# EAGLE schematic ad5272_arduino_ethernet (EAGLE 8.1.1)
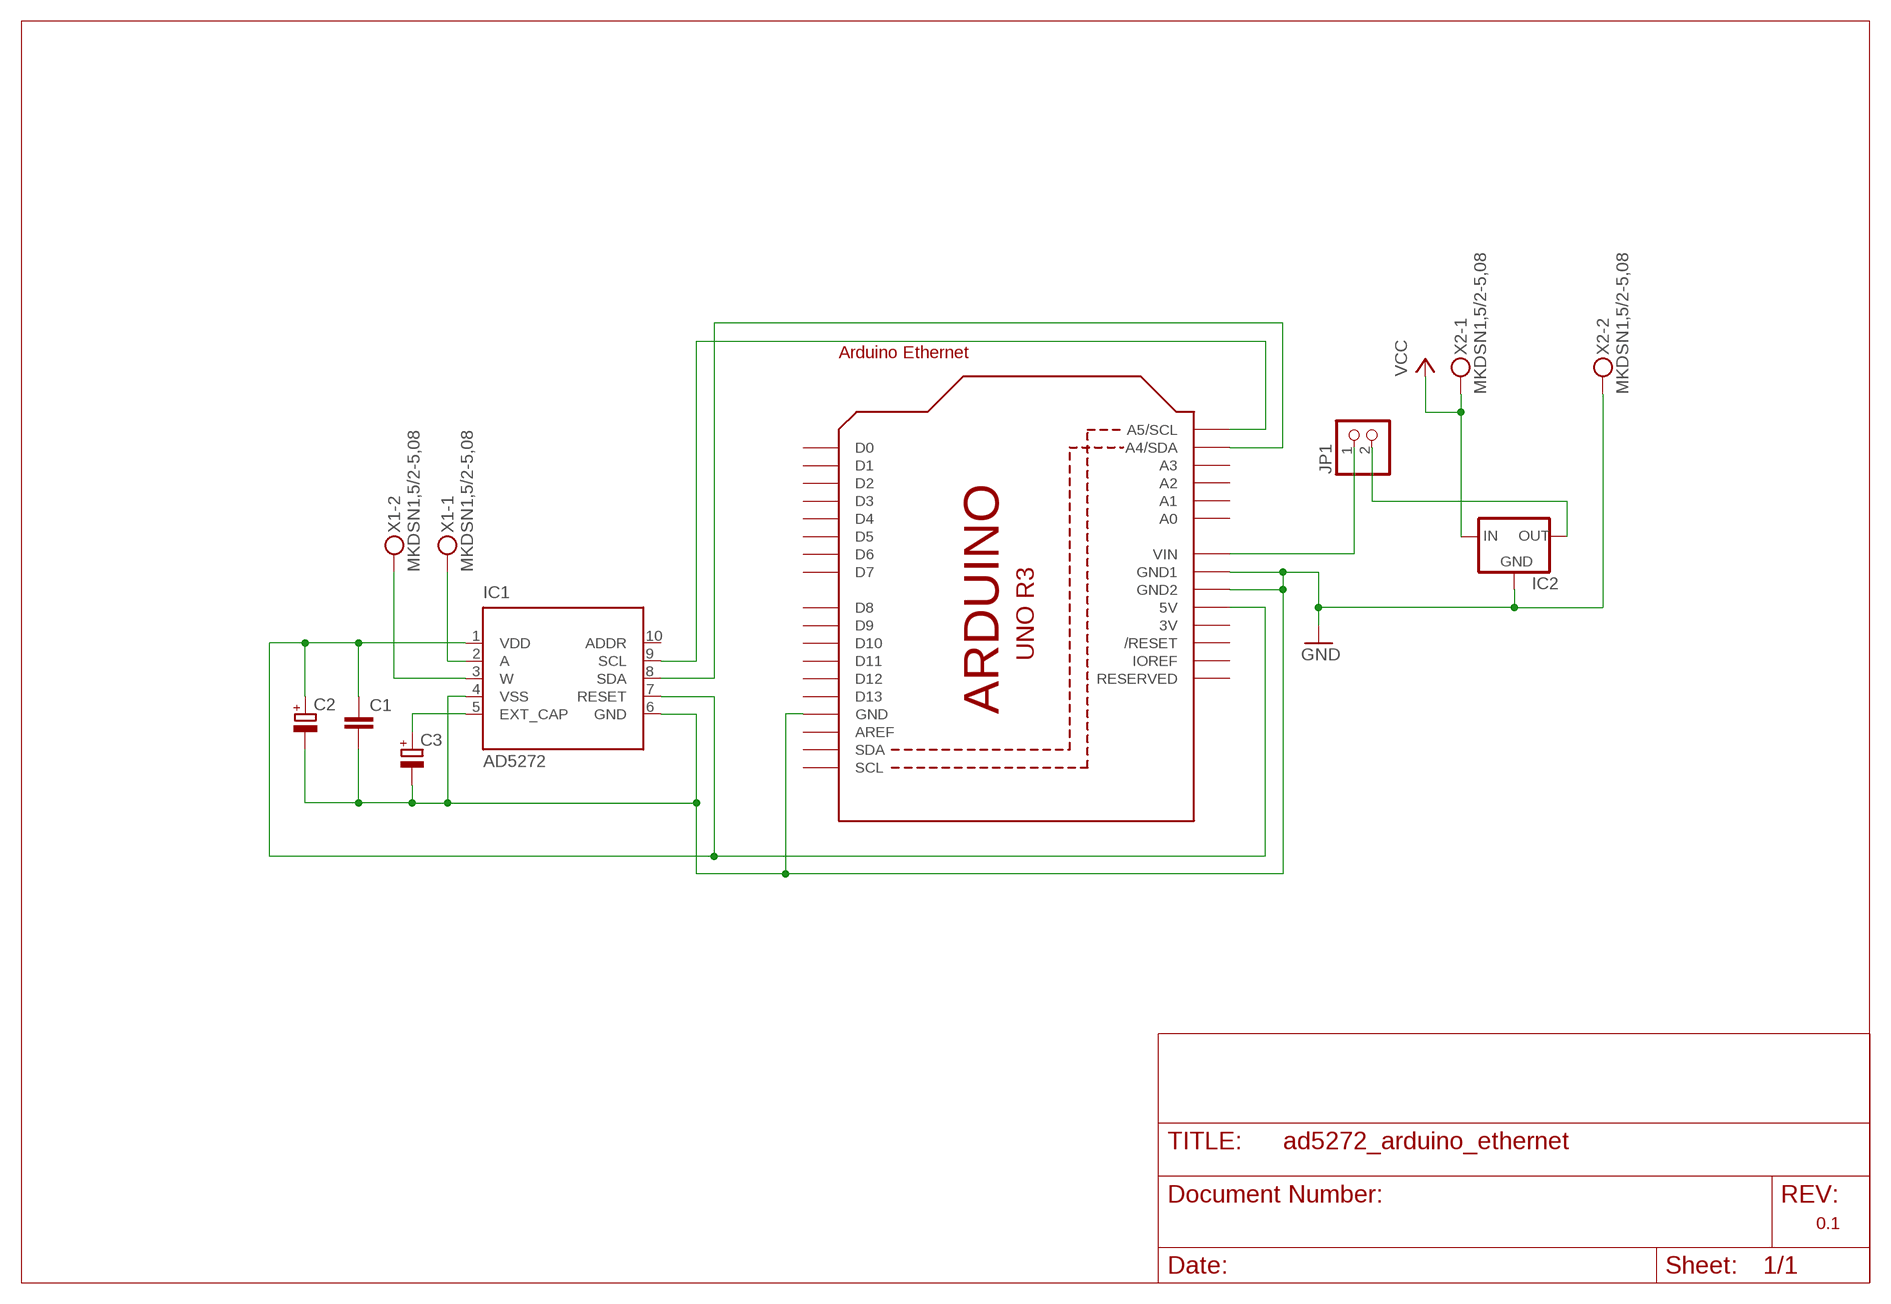
[diagram p0: schematic, sheet 1]

## Parts
C1  C-EU050-024X044  [C050-024X044]
C2  CPOL-EUE2.5-7  [E2,5-7]
C3  CPOL-EUE2.5-7  [E2,5-7]
IC1  AD5272  [MSOP10]
IC2  78XXL  [78XXL]
JP1  PINHD-1X2  [1X02]
U1  ARDUINOR3-DIMENSION  [ARDUINOR3]
X1  MKDSN1,5/2-5,08  [MKDSN1,5/2-5,08]
X2  MKDSN1,5/2-5,08  [MKDSN1,5/2-5,08]

## Nets
GND: C1.2 C2.- C3.- IC1.4(VSS) IC1.6(GND) IC2.GND U1.GND U1.GND1 U1.GND2 X2.2
N$1: IC1.9(SCL) U1.A5(A5/SCL)
N$2: IC1.8(SDA) U1.A4(A4/SDA)
N$3: IC2.OUT JP1.2
N$4: C3.+ IC1.5(EXT_CAP)
N$5: C1.1 C2.+ IC1.1(VDD) IC1.7(RESET) U1.5V
N$6: IC1.3(W) X1.2
N$7: IC1.2(A) X1.1
N$8: JP1.1 U1.VIN
VCC: IC2.IN X2.1
Unconnected: IC1.10(ADDR) U1.A0 U1.A1 U1.A2 U1.A3 U1.AREF U1.D0 U1.D1 U1.D2 U1.D3 U1.D4 U1.D5 U1.D6 U1.D7 U1.D8 U1.D9 U1.D10 U1.D11 U1.D12 U1.D13 U1.IOREF U1.RESERVED U1.RESET(/RESET) U1.SCL U1.SDA

## Notes on the sheet
- Arduino Ethernet
- 0.1

## Power pins joined to a net without a drawn wire
3V: U1.3V

## Library data of the parts
C1 = rcl:C-EU: CAPACITOR, European symbol
C2 C3 = rcl:CPOL-EU: POLARIZED CAPACITOR, European symbol
IC1 = aidj:AD5272: 1024-Position, 1% Resistor Tolerance Error, Single Channel I2C Interface and 50-TP Memory Digital Rheostat 10-Lead MSOP http://www.analog.com/media/en/technical-documentation/data-sheets/AD5272_5274.pdf; MPN: AD7992BRMZ-0; OC_FARNELL: 1078311; OC_NEWARK: 31M4422
IC2 = v-reg:78XXL: VOLTAGE REGULATOR
JP1 = pinhead:PINHD-1X2: PIN HEADER
U1 = adafruit:ARDUINOR3: This is a new object for the new Arduino R3 - with extra pins that you may want to use (such as IOref, and duplicated A4/A5
X1 X2 = con-phoenix-508:MKDSN1,5/2-5,08: MKDSN 1,5/ 2-5,08 Printklemme Nennstrom: 13,5 A Nennspannung: 250 V Rastermaß: 5,08 mm Polzahl: 2 Anschlussart: Schraubanschluss Montage: Löten Anschlussrichtung Leiter/Platine: 0 ° Artikelnummer: 1729128 Source: http://eshop.phoenixcontact.com .. 1729128.pdf; MPN: MKDSN 1,5/2-5.08; OC_FARNELL: 1792903; OC_NEWARK: 30M2397